# EAGLE design remote (EAGLE 7.6.0)
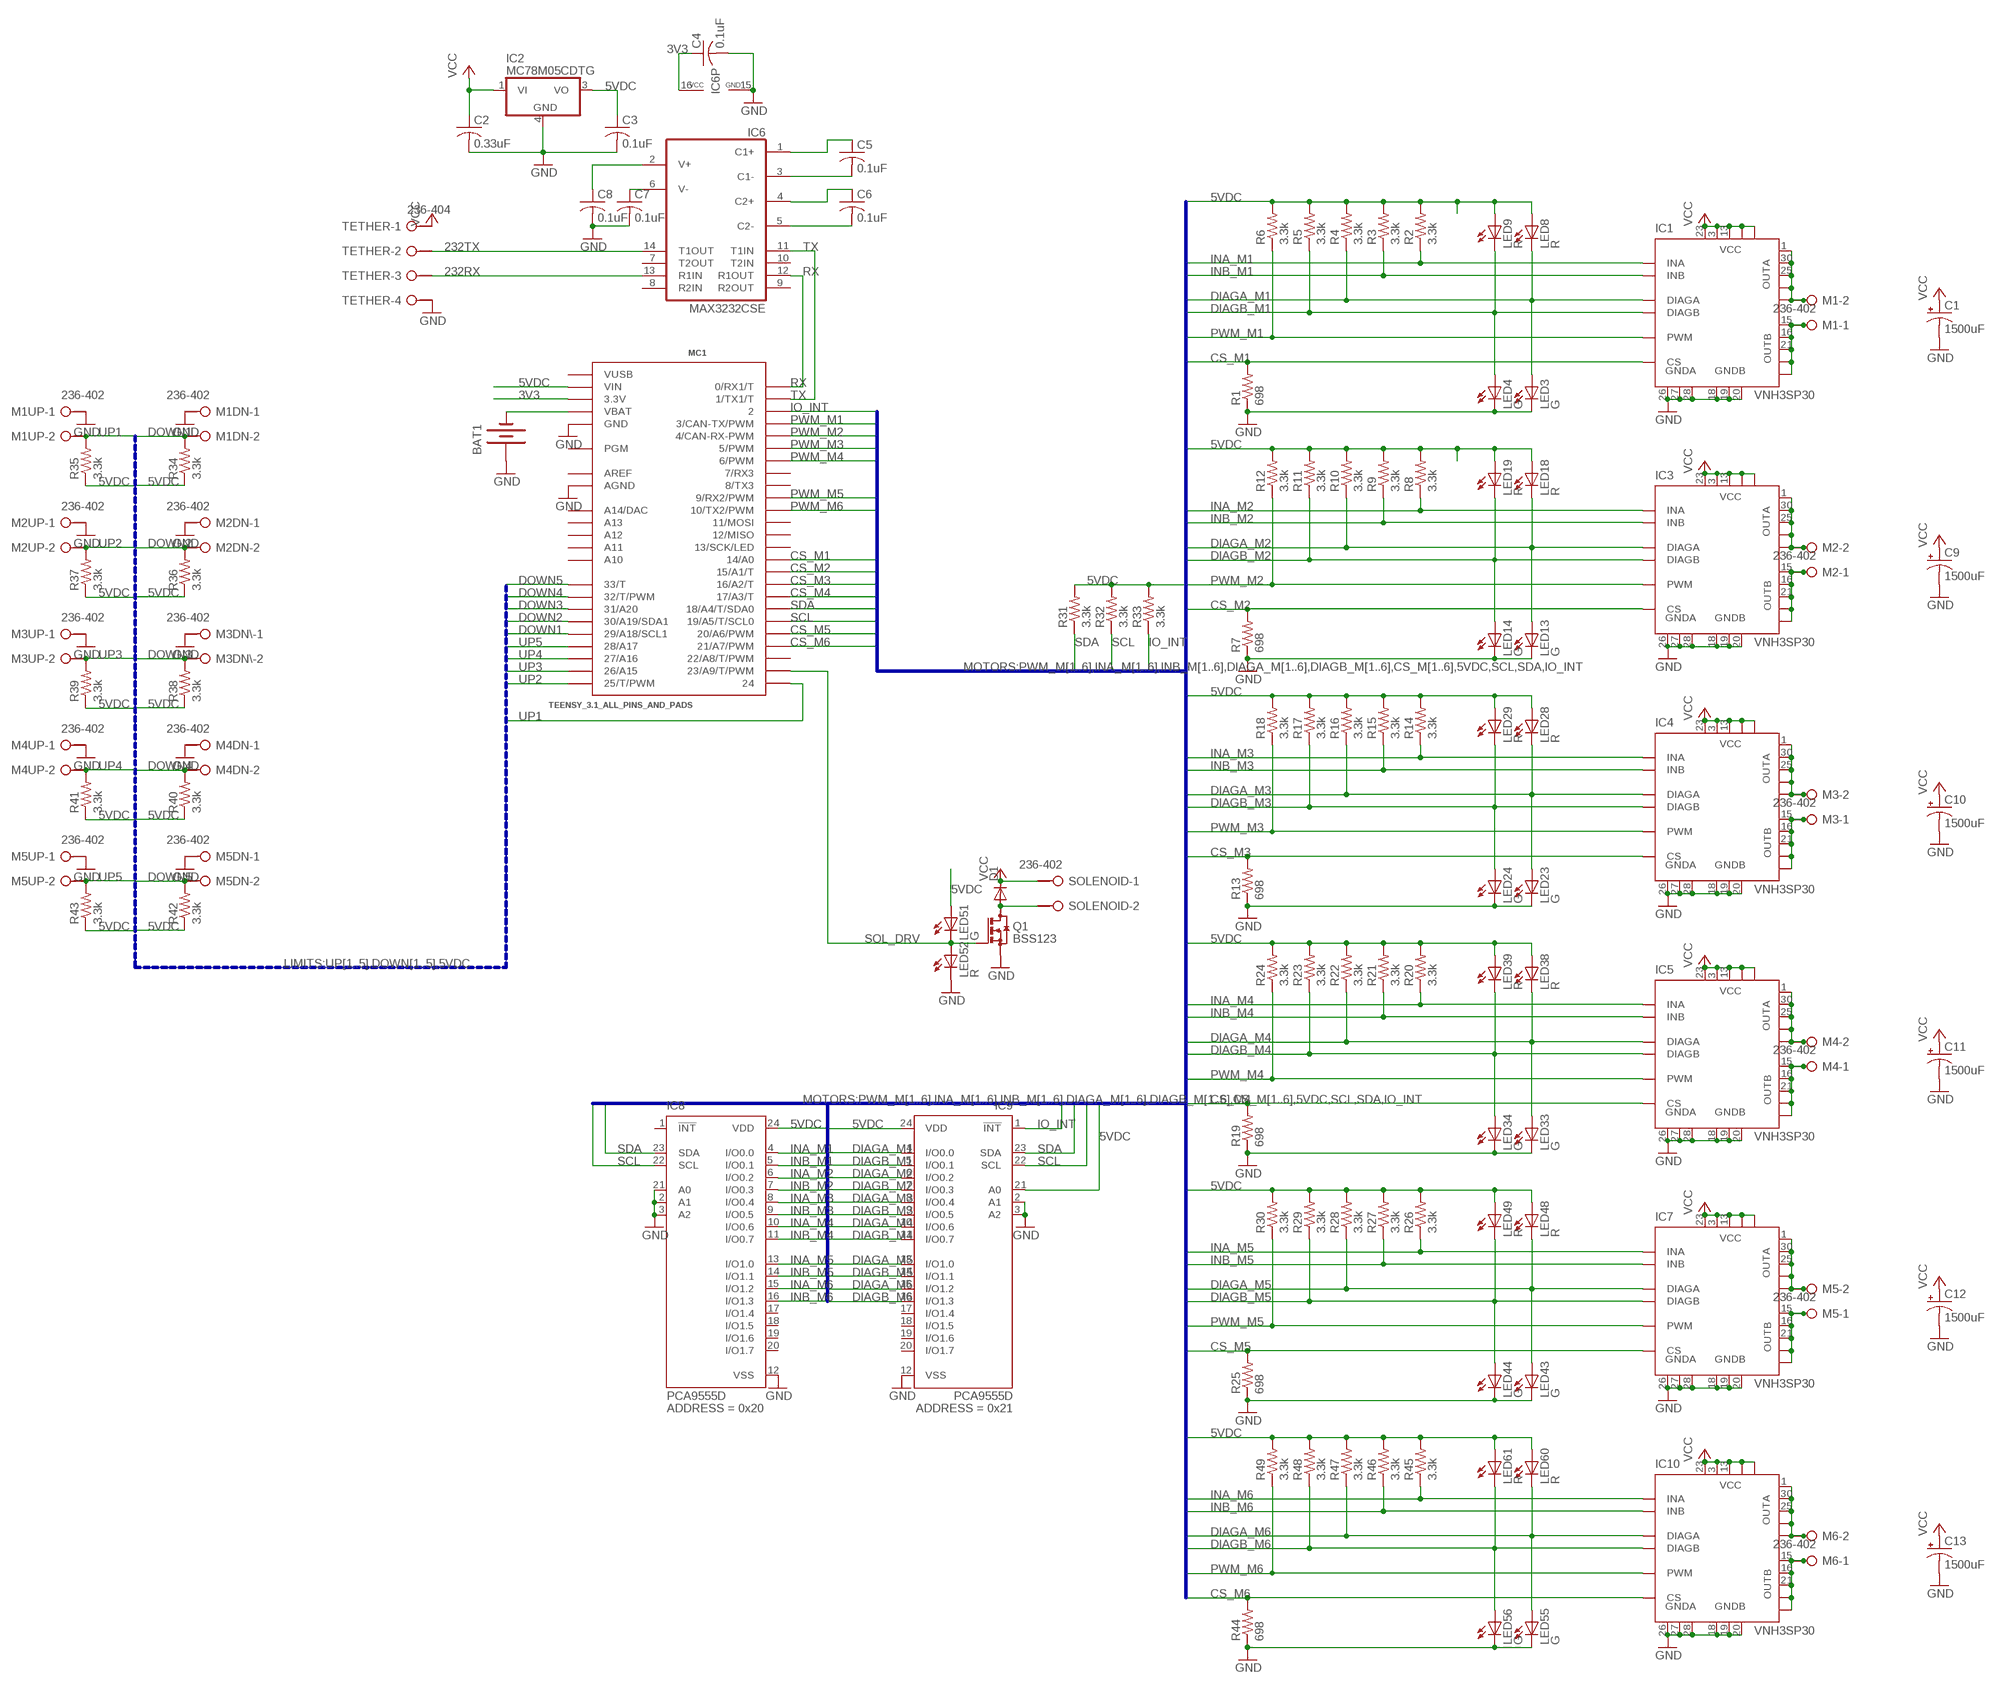
[diagram p0: schematic, sheet 1]

## Parts
BAT1  BATTERY20SMD  [BATTCON_20MM]
C1  1500uF  CPOL-USSANYO_SMD_F12  [SANYO-OSCON_SMD_F12]
C2  0.33uF  C-USC0805  [C0805]
C3  0.1uF  C-USC0805  [C0805]
C4  0.1uF  C-USC0805  [C0805]
C5  0.1uF  C-USC0805  [C0805]
C6  0.1uF  C-USC0805  [C0805]
C7  0.1uF  C-USC0805  [C0805]
C8  0.1uF  C-USC0805  [C0805]
C9  1500uF  CPOL-USSANYO_SMD_F12  [SANYO-OSCON_SMD_F12]
C10  1500uF  CPOL-USSANYO_SMD_F12  [SANYO-OSCON_SMD_F12]
C11  1500uF  CPOL-USSANYO_SMD_F12  [SANYO-OSCON_SMD_F12]
C12  1500uF  CPOL-USSANYO_SMD_F12  [SANYO-OSCON_SMD_F12]
C13  1500uF  CPOL-USSANYO_SMD_F12  [SANYO-OSCON_SMD_F12]
D1  DIODE-DO214AA  [DO214AA]
IC1  VNH3SP30  [MULTIPOWERSO-30]
IC2  MC78M05CDTG  [DPACK_3]
IC3  VNH3SP30  [MULTIPOWERSO-30]
IC4  VNH3SP30  [MULTIPOWERSO-30]
IC5  VNH3SP30  [MULTIPOWERSO-30]
IC6  MAX3232CSE  [SO16]
IC7  VNH3SP30  [MULTIPOWERSO-30]
IC8  PCA9555D  [SO24]
IC9  PCA9555D  [SO24]
IC10  VNH3SP30  [MULTIPOWERSO-30]
LED3  G  LEDCHIP-LED0805  [CHIP-LED0805]
LED4  G  LEDCHIP-LED0805  [CHIP-LED0805]
LED8  R  LEDCHIP-LED0805  [CHIP-LED0805]
LED9  R  LEDCHIP-LED0805  [CHIP-LED0805]
LED13  G  LEDCHIP-LED0805  [CHIP-LED0805]
LED14  G  LEDCHIP-LED0805  [CHIP-LED0805]
LED18  R  LEDCHIP-LED0805  [CHIP-LED0805]
LED19  R  LEDCHIP-LED0805  [CHIP-LED0805]
LED23  G  LEDCHIP-LED0805  [CHIP-LED0805]
LED24  G  LEDCHIP-LED0805  [CHIP-LED0805]
LED28  R  LEDCHIP-LED0805  [CHIP-LED0805]
LED29  R  LEDCHIP-LED0805  [CHIP-LED0805]
LED33  G  LEDCHIP-LED0805  [CHIP-LED0805]
LED34  G  LEDCHIP-LED0805  [CHIP-LED0805]
LED38  R  LEDCHIP-LED0805  [CHIP-LED0805]
LED39  R  LEDCHIP-LED0805  [CHIP-LED0805]
LED43  G  LEDCHIP-LED0805  [CHIP-LED0805]
LED44  G  LEDCHIP-LED0805  [CHIP-LED0805]
LED48  R  LEDCHIP-LED0805  [CHIP-LED0805]
LED49  R  LEDCHIP-LED0805  [CHIP-LED0805]
LED51  G  LEDCHIP-LED0805  [CHIP-LED0805]
LED52  R  LEDCHIP-LED0805  [CHIP-LED0805]
LED55  G  LEDCHIP-LED0805  [CHIP-LED0805]
LED56  G  LEDCHIP-LED0805  [CHIP-LED0805]
LED60  R  LEDCHIP-LED0805  [CHIP-LED0805]
LED61  R  LEDCHIP-LED0805  [CHIP-LED0805]
M1  236-402  [236-402]
M1DN  236-402  [236-402]
M1UP  236-402  [236-402]
M2  236-402  [236-402]
M2DN  236-402  [236-402]
M2UP  236-402  [236-402]
M3  236-402  [236-402]
M3DN\  236-402  [236-402]
M3UP  236-402  [236-402]
M4  236-402  [236-402]
M4DN  236-402  [236-402]
M4UP  236-402  [236-402]
M5  236-402  [236-402]
M5DN  236-402  [236-402]
M5UP  236-402  [236-402]
M6  236-402  [236-402]
MC1  TEENSY_3.1_ALL_PINS_AND_PADS  [TEENSY3_ALL_PINS_&_PADS]
Q1  BSS123  [SOT23]
R1  698  R-US_R0805  [R0805]
R2  3.3k  R-US_R0805  [R0805]
R3  3.3k  R-US_R0805  [R0805]
R4  3.3k  R-US_R0805  [R0805]
R5  3.3k  R-US_R0805  [R0805]
R6  3.3k  R-US_R0805  [R0805]
R7  698  R-US_R0805  [R0805]
R8  3.3k  R-US_R0805  [R0805]
R9  3.3k  R-US_R0805  [R0805]
R10  3.3k  R-US_R0805  [R0805]
R11  3.3k  R-US_R0805  [R0805]
R12  3.3k  R-US_R0805  [R0805]
R13  698  R-US_R0805  [R0805]
R14  3.3k  R-US_R0805  [R0805]
R15  3.3k  R-US_R0805  [R0805]
R16  3.3k  R-US_R0805  [R0805]
R17  3.3k  R-US_R0805  [R0805]
R18  3.3k  R-US_R0805  [R0805]
R19  698  R-US_R0805  [R0805]
R20  3.3k  R-US_R0805  [R0805]
R21  3.3k  R-US_R0805  [R0805]
R22  3.3k  R-US_R0805  [R0805]
R23  3.3k  R-US_R0805  [R0805]
R24  3.3k  R-US_R0805  [R0805]
R25  698  R-US_R0805  [R0805]
R26  3.3k  R-US_R0805  [R0805]
R27  3.3k  R-US_R0805  [R0805]
R28  3.3k  R-US_R0805  [R0805]
R29  3.3k  R-US_R0805  [R0805]
R30  3.3k  R-US_R0805  [R0805]
R31  3.3k  R-US_R0805  [R0805]
R32  3.3k  R-US_R0805  [R0805]
R33  3.3k  R-US_R0805  [R0805]
R34  3.3k  R-US_R0805  [R0805]
R35  3.3k  R-US_R0805  [R0805]
R36  3.3k  R-US_R0805  [R0805]
R37  3.3k  R-US_R0805  [R0805]
R38  3.3k  R-US_R0805  [R0805]
R39  3.3k  R-US_R0805  [R0805]
R40  3.3k  R-US_R0805  [R0805]
R41  3.3k  R-US_R0805  [R0805]
R42  3.3k  R-US_R0805  [R0805]
R43  3.3k  R-US_R0805  [R0805]
R44  698  R-US_R0805  [R0805]
R45  3.3k  R-US_R0805  [R0805]
R46  3.3k  R-US_R0805  [R0805]
R47  3.3k  R-US_R0805  [R0805]
R48  3.3k  R-US_R0805  [R0805]
R49  3.3k  R-US_R0805  [R0805]
SOLENOID  236-402  [236-402]
TETHER  236-404  [236-404]

## Nets
3V3: C4.1 IC6.16(VCC) MC1.3.3V MC1.3.3V1(3.3V) MC1.3.3V2(3.3V)
5VDC: C3.1 IC2.3(VO) IC8.24(VDD) IC9.21(A0) IC9.24(VDD) LED8.A LED9.A LED18.A LED19.A LED28.A LED29.A LED38.A LED39.A LED48.A LED49.A LED51.A LED60.A LED61.A MC1.VIN R2.2 R3.2 R4.2 R5.2 R6.2 R8.2 R9.2 R10.2 R11.2 R12.2 R14.2 R15.2 R16.2 R17.2 R18.2 R20.2 R21.2 R22.2 R23.2 R24.2 R26.2 R27.2 R28.2 R29.2 R30.2 R31.2 R32.2 R33.2 R34.1 R35.1 R36.1 R37.1 R38.1 R39.1 R40.1 R41.1 R42.1 R43.1 R45.2 R46.2 R47.2 R48.2 R49.2
232RX: IC6.13(R1IN) TETHER.3@1(-3:KL1)
232TX: IC6.14(T1OUT) TETHER.2@1(-2:KL1)
CS_M1: IC1.9(CS) MC1.14/A0 R1.2
CS_M2: IC3.9(CS) MC1.15/A1(15/A1/T) R7.2
CS_M3: IC4.9(CS) MC1.16/A2(16/A2/T) R13.2
CS_M4: IC5.9(CS) MC1.17/A3(17/A3/T) R19.2
CS_M5: IC7.9(CS) MC1.20/A6(20/A6/PWM) R25.2
CS_M6: IC10.9(CS) MC1.21/A7(21/A7/PWM) R44.2
DIAGA_M1: IC1.6(DIAGA) IC9.4(I/O0.0) LED3.A LED8.C R4.1
DIAGA_M2: IC3.6(DIAGA) IC9.6(I/O0.2) LED13.A LED18.C R10.1
DIAGA_M3: IC4.6(DIAGA) IC9.8(I/O0.4) LED23.A LED28.C R16.1
DIAGA_M4: IC5.6(DIAGA) IC9.10(I/O0.6) LED33.A LED38.C R22.1
DIAGA_M5: IC7.6(DIAGA) IC9.13(I/O1.0) LED43.A LED48.C R28.1
DIAGA_M6: IC9.15(I/O1.2) IC10.6(DIAGA) LED55.A LED60.C R47.1
DIAGB_M1: IC1.10(DIAGB) IC9.5(I/O0.1) LED4.A LED9.C R5.1
DIAGB_M2: IC3.10(DIAGB) IC9.7(I/O0.3) LED14.A LED19.C R11.1
DIAGB_M3: IC4.10(DIAGB) IC9.9(I/O0.5) LED24.A LED29.C R17.1
DIAGB_M4: IC5.10(DIAGB) IC9.11(I/O0.7) LED34.A LED39.C R23.1
DIAGB_M5: IC7.10(DIAGB) IC9.14(I/O1.1) LED44.A LED49.C R29.1
DIAGB_M6: IC9.16(I/O1.3) IC10.10(DIAGB) LED56.A LED61.C R48.1
DOWN1: M1DN.2@1(-2:KL1) MC1.29(29/A18/SCL1) R34.2
DOWN2: M2DN.2@1(-2:KL1) MC1.30(30/A19/SDA1) R36.2
DOWN3: M3DN\.2@1(-2:KL1) MC1.31(31/A20) R38.2
DOWN4: M4DN.2@1(-2:KL1) MC1.32(32/T/PWM) R40.2
DOWN5: M5DN.2@1(-2:KL1) MC1.33(33/T) R42.2
GND: BAT1.1(+) C1.- C2.2 C3.2 C4.2 C7.2 C8.2 C9.- C10.- C11.- C12.- C13.- IC1.18(GNDB) IC1.19(GNDB) IC1.20(GNDB) IC1.26(GNDA) IC1.27(GNDA) IC1.28(GNDA) IC2.4(GND) IC3.18(GNDB) IC3.19(GNDB) IC3.20(GNDB) IC3.26(GNDA) IC3.27(GNDA) IC3.28(GNDA) IC4.18(GNDB) IC4.19(GNDB) IC4.20(GNDB) IC4.26(GNDA) IC4.27(GNDA) IC4.28(GNDA) IC5.18(GNDB) IC5.19(GNDB) IC5.20(GNDB) IC5.26(GNDA) IC5.27(GNDA) IC5.28(GNDA) IC6.15(GND) IC7.18(GNDB) IC7.19(GNDB) IC7.20(GNDB) IC7.26(GNDA) IC7.27(GNDA) IC7.28(GNDA) IC8.2(A1) IC8.3(A2) IC8.12(VSS) IC8.21(A0) IC9.2(A1) IC9.3(A2) IC9.12(VSS) IC10.18(GNDB) IC10.19(GNDB) IC10.20(GNDB) IC10.26(GNDA) IC10.27(GNDA) IC10.28(GNDA) LED3.C LED4.C LED13.C LED14.C LED23.C LED24.C LED33.C LED34.C LED43.C LED44.C LED52.C LED55.C LED56.C M1DN.1@1(-1:KL1) M1UP.1@1(-1:KL1) M2DN.1@1(-1:KL1) M2UP.1@1(-1:KL1) M3DN\.1@1(-1:KL1) M3UP.1@1(-1:KL1) M4DN.1@1(-1:KL1) M4UP.1@1(-1:KL1) M5DN.1@1(-1:KL1) M5UP.1@1(-1:KL1) MC1.AGND MC1.GND MC1.GND1(GND) MC1.GND2(GND) Q1.2(S) R1.1 R7.1 R13.1 R19.1 R25.1 R44.1 TETHER.4@1(-4:KL1)
INA_M1: IC1.5(INA) IC8.4(I/O0.0) R2.1
INA_M2: IC3.5(INA) IC8.6(I/O0.2) R8.1
INA_M3: IC4.5(INA) IC8.8(I/O0.4) R14.1
INA_M4: IC5.5(INA) IC8.10(I/O0.6) R20.1
INA_M5: IC7.5(INA) IC8.13(I/O1.0) R26.1
INA_M6: IC8.15(I/O1.2) IC10.5(INA) R45.1
INB_M1: IC1.11(INB) IC8.5(I/O0.1) R3.1
INB_M2: IC3.11(INB) IC8.7(I/O0.3) R9.1
INB_M3: IC4.11(INB) IC8.9(I/O0.5) R15.1
INB_M4: IC5.11(INB) IC8.11(I/O0.7) R21.1
INB_M5: IC7.11(INB) IC8.14(I/O1.1) R27.1
INB_M6: IC8.16(I/O1.3) IC10.11(INB) R46.1
IO_INT: IC9.1(!INT) MC1.2 R33.1
M1A: IC1.1(OUTA) IC1.25(OUTA) IC1.30(OUTA) IC1.OUTA IC1.OUTA@1(OUTA) M1.2@1(-2:KL1) M1.2@2(-2:KL2)
M1B: IC1.15(OUTB) IC1.16(OUTB) IC1.21(OUTB) IC1.OUTB IC1.OUTB@1(OUTB) M1.1@1(-1:KL1) M1.1@2(-1:KL2)
M2A: IC3.1(OUTA) IC3.25(OUTA) IC3.30(OUTA) IC3.OUTA IC3.OUTA@1(OUTA) M2.2@1(-2:KL1) M2.2@2(-2:KL2)
M2B: IC3.15(OUTB) IC3.16(OUTB) IC3.21(OUTB) IC3.OUTB IC3.OUTB@1(OUTB) M2.1@1(-1:KL1) M2.1@2(-1:KL2)
M3A: IC4.1(OUTA) IC4.25(OUTA) IC4.30(OUTA) IC4.OUTA IC4.OUTA@1(OUTA) M3.2@1(-2:KL1) M3.2@2(-2:KL2)
M3B: IC4.15(OUTB) IC4.16(OUTB) IC4.21(OUTB) IC4.OUTB IC4.OUTB@1(OUTB) M3.1@1(-1:KL1) M3.1@2(-1:KL2)
M4A: IC5.1(OUTA) IC5.25(OUTA) IC5.30(OUTA) IC5.OUTA IC5.OUTA@1(OUTA) M4.2@1(-2:KL1) M4.2@2(-2:KL2)
M4B: IC5.15(OUTB) IC5.16(OUTB) IC5.21(OUTB) IC5.OUTB IC5.OUTB@1(OUTB) M4.1@1(-1:KL1) M4.1@2(-1:KL2)
M5A: IC7.1(OUTA) IC7.25(OUTA) IC7.30(OUTA) IC7.OUTA IC7.OUTA@1(OUTA) M5.2@1(-2:KL1) M5.2@2(-2:KL2)
M5B: IC7.15(OUTB) IC7.16(OUTB) IC7.21(OUTB) IC7.OUTB IC7.OUTB@1(OUTB) M5.1@1(-1:KL1) M5.1@2(-1:KL2)
M6A: IC10.1(OUTA) IC10.25(OUTA) IC10.30(OUTA) IC10.OUTA IC10.OUTA@1(OUTA) M6.2@1(-2:KL1) M6.2@2(-2:KL2)
M6B: IC10.15(OUTB) IC10.16(OUTB) IC10.21(OUTB) IC10.OUTB IC10.OUTB@1(OUTB) M6.1@1(-1:KL1) M6.1@2(-1:KL2)
N$1: C5.1 IC6.1(C1+)
N$2: C5.2 IC6.3(C1-)
N$3: C6.1 IC6.4(C2+)
N$4: C6.2 IC6.5(C2-)
N$7: C8.1 IC6.2(V+)
N$8: C7.1 IC6.6(V-)
N$17: BAT1.2(-) MC1.VBAT
N$19: D1.A Q1.3(D) SOLENOID.2@1(-2:KL1)
PWM_M1: IC1.8(PWM) MC1.3(3/CAN-TX/PWM) R6.1
PWM_M2: IC3.8(PWM) MC1.4(4/CAN-RX-PWM) R12.1
PWM_M3: IC4.8(PWM) MC1.5(5/PWM) R18.1
PWM_M4: IC5.8(PWM) MC1.6(6/PWM) R24.1
PWM_M5: IC7.8(PWM) MC1.9(9/RX2/PWM) R30.1
PWM_M6: IC10.8(PWM) MC1.10(10/TX2/PWM) R49.1
RX: IC6.12(R1OUT) MC1.0(0/RX1/T)
SCL: IC8.22(SCL) IC9.22(SCL) MC1.19/A5(19/A5/T/SCL0) R32.1
SDA: IC8.23(SDA) IC9.23(SDA) MC1.18/A4(18/A4/T/SDA0) R31.1
SOL_DRV: LED51.C LED52.A MC1.23/A9(23/A9/T/PWM) Q1.1(G)
TX: IC6.11(T1IN) MC1.1(1/TX1/T)
UP1: M1UP.2@1(-2:KL1) MC1.24 R35.2
UP2: M2UP.2@1(-2:KL1) MC1.25(25/T/PWM) R37.2
UP3: M3UP.2@1(-2:KL1) MC1.26(26/A15) R39.2
UP4: M4UP.2@1(-2:KL1) MC1.27(27/A16) R41.2
UP5: M5UP.2@1(-2:KL1) MC1.28(28/A17) R43.2
VCC: C1.+ C2.1 C9.+ C10.+ C11.+ C12.+ C13.+ D1.C IC1.3(VCC) IC1.13(VCC) IC1.23(VCC) IC1.VCC IC1.VCC@1(VCC) IC2.1(VI) IC3.3(VCC) IC3.13(VCC) IC3.23(VCC) IC3.VCC IC3.VCC@1(VCC) IC4.3(VCC) IC4.13(VCC) IC4.23(VCC) IC4.VCC IC4.VCC@1(VCC) IC5.3(VCC) IC5.13(VCC) IC5.23(VCC) IC5.VCC IC5.VCC@1(VCC) IC7.3(VCC) IC7.13(VCC) IC7.23(VCC) IC7.VCC IC7.VCC@1(VCC) IC10.3(VCC) IC10.13(VCC) IC10.23(VCC) IC10.VCC IC10.VCC@1(VCC) SOLENOID.1@1(-1:KL1) TETHER.1@1(-1:KL1)
Unconnected: IC6.7(T2OUT) IC6.8(R2IN) IC6.9(R2OUT) IC6.10(T2IN) IC8.1(!INT) IC8.17(I/O1.4) IC8.18(I/O1.5) IC8.19(I/O1.6) IC8.20(I/O1.7) IC9.17(I/O1.4) IC9.18(I/O1.5) IC9.19(I/O1.6) IC9.20(I/O1.7) M1DN.1@2(-1:KL2) M1DN.2@2(-2:KL2) M1UP.1@2(-1:KL2) M1UP.2@2(-2:KL2) M2DN.1@2(-1:KL2) M2DN.2@2(-2:KL2) M2UP.1@2(-1:KL2) M2UP.2@2(-2:KL2) M3DN\.1@2(-1:KL2) M3DN\.2@2(-2:KL2) M3UP.1@2(-1:KL2) M3UP.2@2(-2:KL2) M4DN.1@2(-1:KL2) M4DN.2@2(-2:KL2) M4UP.1@2(-1:KL2) M4UP.2@2(-2:KL2) M5DN.1@2(-1:KL2) M5DN.2@2(-2:KL2) M5UP.1@2(-1:KL2) M5UP.2@2(-2:KL2) MC1.7(7/RX3) MC1.8(8/TX3) MC1.11(11/MOSI) MC1.12(12/MISO) MC1.13(13/SCK/LED) MC1.22/A8(22/A8/T/PWM) MC1.A10 MC1.A11 MC1.A12 MC1.A13 MC1.PGM MC1.RESET/DAC(A14/DAC) SOLENOID.1@2(-1:KL2) SOLENOID.2@2(-2:KL2) TETHER.1@2(-1:KL2) TETHER.2@2(-2:KL2) TETHER.3@2(-3:KL2) TETHER.4@2(-4:KL2)

## Buses
MOTORS:PWM_M[1..6],INA_M[1..6],INB_M[1..6],DIAGA_M[1..6],DIAGB_M[1..6],CS_M[1..6],5VDC,SCL,SDA,IO_INT
LIMITS:UP[1..5],DOWN[1..5],5VDC

## Power pins joined to a net without a drawn wire
AREF: MC1.AREF
VUSB: MC1.VUSB

## Library data of the parts
BAT1 = SparkFun-Electromechanical:BATTERY: Battery Holders Various common sizes : AA, AAA, 18650 (PRT-12895), 20mm coin cell and 12mm coin cell. 20MM_4LEGS, BATT-10373
C1 C9-C13 = rcl:CPOL-US: POLARIZED CAPACITOR, American symbol
C2-C8 = rcl:C-US: CAPACITOR, American symbol
D1 = diode:DIODE-: DIODE
IC1 IC3-IC5 IC7 IC10 = st-microelectronics:VNH3SP30: FULLY INTEGRATED H-BRIDGE MOTOR DRIVER Source: http://pdf1.alldatasheet.com/datasheet-pdf/view/84563/STMICROELECTRONICS/VNH3SP30.html; MPN: VNH3SP30-E; OC_FARNELL: 1739420; OC_NEWARK: 33R1486
IC2 = linear:MC78M: 500 mA Positive Voltage Regulators Source: Data sheet <http://www.onsemi.com/pub_link/Collateral/MC78M00-D.PDF>
IC6 = maxim:MAX3232*: True RS-232 Transceivers 3.0V to 5.5V, Low-Power up to 1Mbps, Using Four 0.1µF External Capacitors Source: http://pdfserv.maxim-ic.com/en/ds/MAX3222-MAX3241.pdf; MPN: MAX3232CSE; OC_FARNELL: 9725490; OC_NEWARK: 90C2890
IC8 = micro-philips:PCA9555: 16-bit I2C and SMBus I/O port with interrupt Source: PCA9555_5.pdf; ADDRESS: 0x20; MPN: PCA9555DW; OC_FARNELL: 1408295; OC_NEWARK: 63K6067
IC9 = micro-philips:PCA9555: 16-bit I2C and SMBus I/O port with interrupt Source: PCA9555_5.pdf; ADDRESS: 0x21; MPN: PCA9555DW; OC_FARNELL: 1408295; OC_NEWARK: 63K6067
LED3 LED4 LED8 LED9 LED13 LED14 LED18 LED19 LED23 LED24 LED28 LED29 LED33 LED34 LED38 LED39 LED43 LED44 LED48 LED49 LED51 LED52 LED55 LED56 LED60 LED61 = led:LED: LED OSRAM: - CHIPLED LG R971, LG N971, LY N971, LG Q971, LY Q971, LO R971, LY R971 LH N974, LH R974 LS Q976, LO Q976, LY Q976 LO Q996 - Hyper CHIPLED LW Q18S LB Q993, LB Q99A, LB R99A - SideLED LS A670, LO A670, LY A670, LG A670, LP A670 LB A673, LV A673, LT A673, LW A673 LH A674 LY A675 LS A676, LA A676, LO A676, LY A676, LW A676 LS A679, LY A679, LG A679 - Hyper Micro SIDELED® LS Y876, LA Y876, LO Y876, LY Y876 LT Y87S - SmartLED LW L88C, LW L88S LB L89C, LB L89S, LG L890 LS L89K, LO L89K, LY L89K LS L896, LA L896, LO L896, LY L896 - TOPLED LS T670, LO T670, LY T670, LG T670, LP T670 LSG T670, LSP T670, LSY T670, LOP T670, LYG T670 LG T671, LOG T671, LSG T671 LB T673, LV T673, LT T673, LW T673 LH T674 LS T676, LA T676, LO T676, LY T676, LB T676, LH T676, LSB T676, LW T676 LB T67C, LV T67C, LT T67C, LS T67K, LO T67K, LY T67K, LW E67C LS E67B, LA E67B, LO E67B, LY E67B, LB E67C, LV E67C, LT E67C LW T67C LS T679, LY T679, LG T679 LS T770, LO T770, LY T770, LG T770, LP T770 LB T773, LV T773, LT T773, LW T773 LH T774 LS E675, LA E675, LY E675, LS T675 LS T776, LA T776, LO T776, LY T776, LB T776 LHGB T686 LT T68C, LB T68C - Hyper Mini TOPLED® LB M676 - Mini TOPLED Santana® LG M470 LS M47K, LO M47K, LY M47K Source: http://www.osram.convergy.de LUXEON: - LUMILED® LXK2-PW12-R00, LXK2-PW12-S00, LXK2-PW14-U00, LXK2-PW14-V00 LXK2-PM12-R00, LXK2-PM12-S00, LXK2-PM14-U00 LXK2-PE12-Q00, LXK2-PE12-R00, LXK2-PE12-S00, LXK2-PE14-T00, LXK2-PE14-U00 LXK2-PB12-K00, LXK2-PB12-L00, LXK2-PB12-M00, LXK2-PB14-N00, LXK2-PB14-P00, LXK2-PB14-Q00 LXK2-PR12-L00, LXK2-PR12-M00, LXK2-PR14-Q00, LXK2-PR14-R00 LXK2-PD12-Q00, LXK2-PD12-R00, LXK2-PD12-S00 LXK2-PH12-R00, LXK2-PH12-S00 LXK2-PL12-P00, LXK2-PL12-Q00, LXK2-PL12-R00 Source: www.luxeon.com KINGBRIGHT: KA-3528ASYC Source: www.kingbright.com
M1 M1DN M1UP M2 M2DN M2UP M3 M3DN\ M3UP M4 M4DN M4UP M5 M5DN M5UP M6 SOLENOID = con-wago-508:236-402: Terminal Strips 2.5 mm2/AWG 12, Series 236, Pin Spacings 5/5.08 mm Source: Data sheet <http://www.farnell.com/datasheets/63479.pdf>
MC1 = Teensy_3_and_LC_Series_Boards_v1.1:TEENSY_3.1_ALL_PINS_AND_PADS: Footprint for Teensy 3.1 or 3.2 board using all pads and all through-holes. Pads need a 2x7 0.1" SMD header.
Q1 = transistor-small-signal:BSS123: N-CHANNEL MOS FET
R1-R49 = resistor:R-US_: RESISTOR, American symbol
TETHER = con-wago-508:236-404: Terminal Strips 2.5 mm2/AWG 12, Series 236, Pin Spacings 5/5.08 mm Source: Data sheet <http://www.farnell.com/datasheets/63479.pdf>

## Net classes
0 default: clearance 0.205 mm

## Board
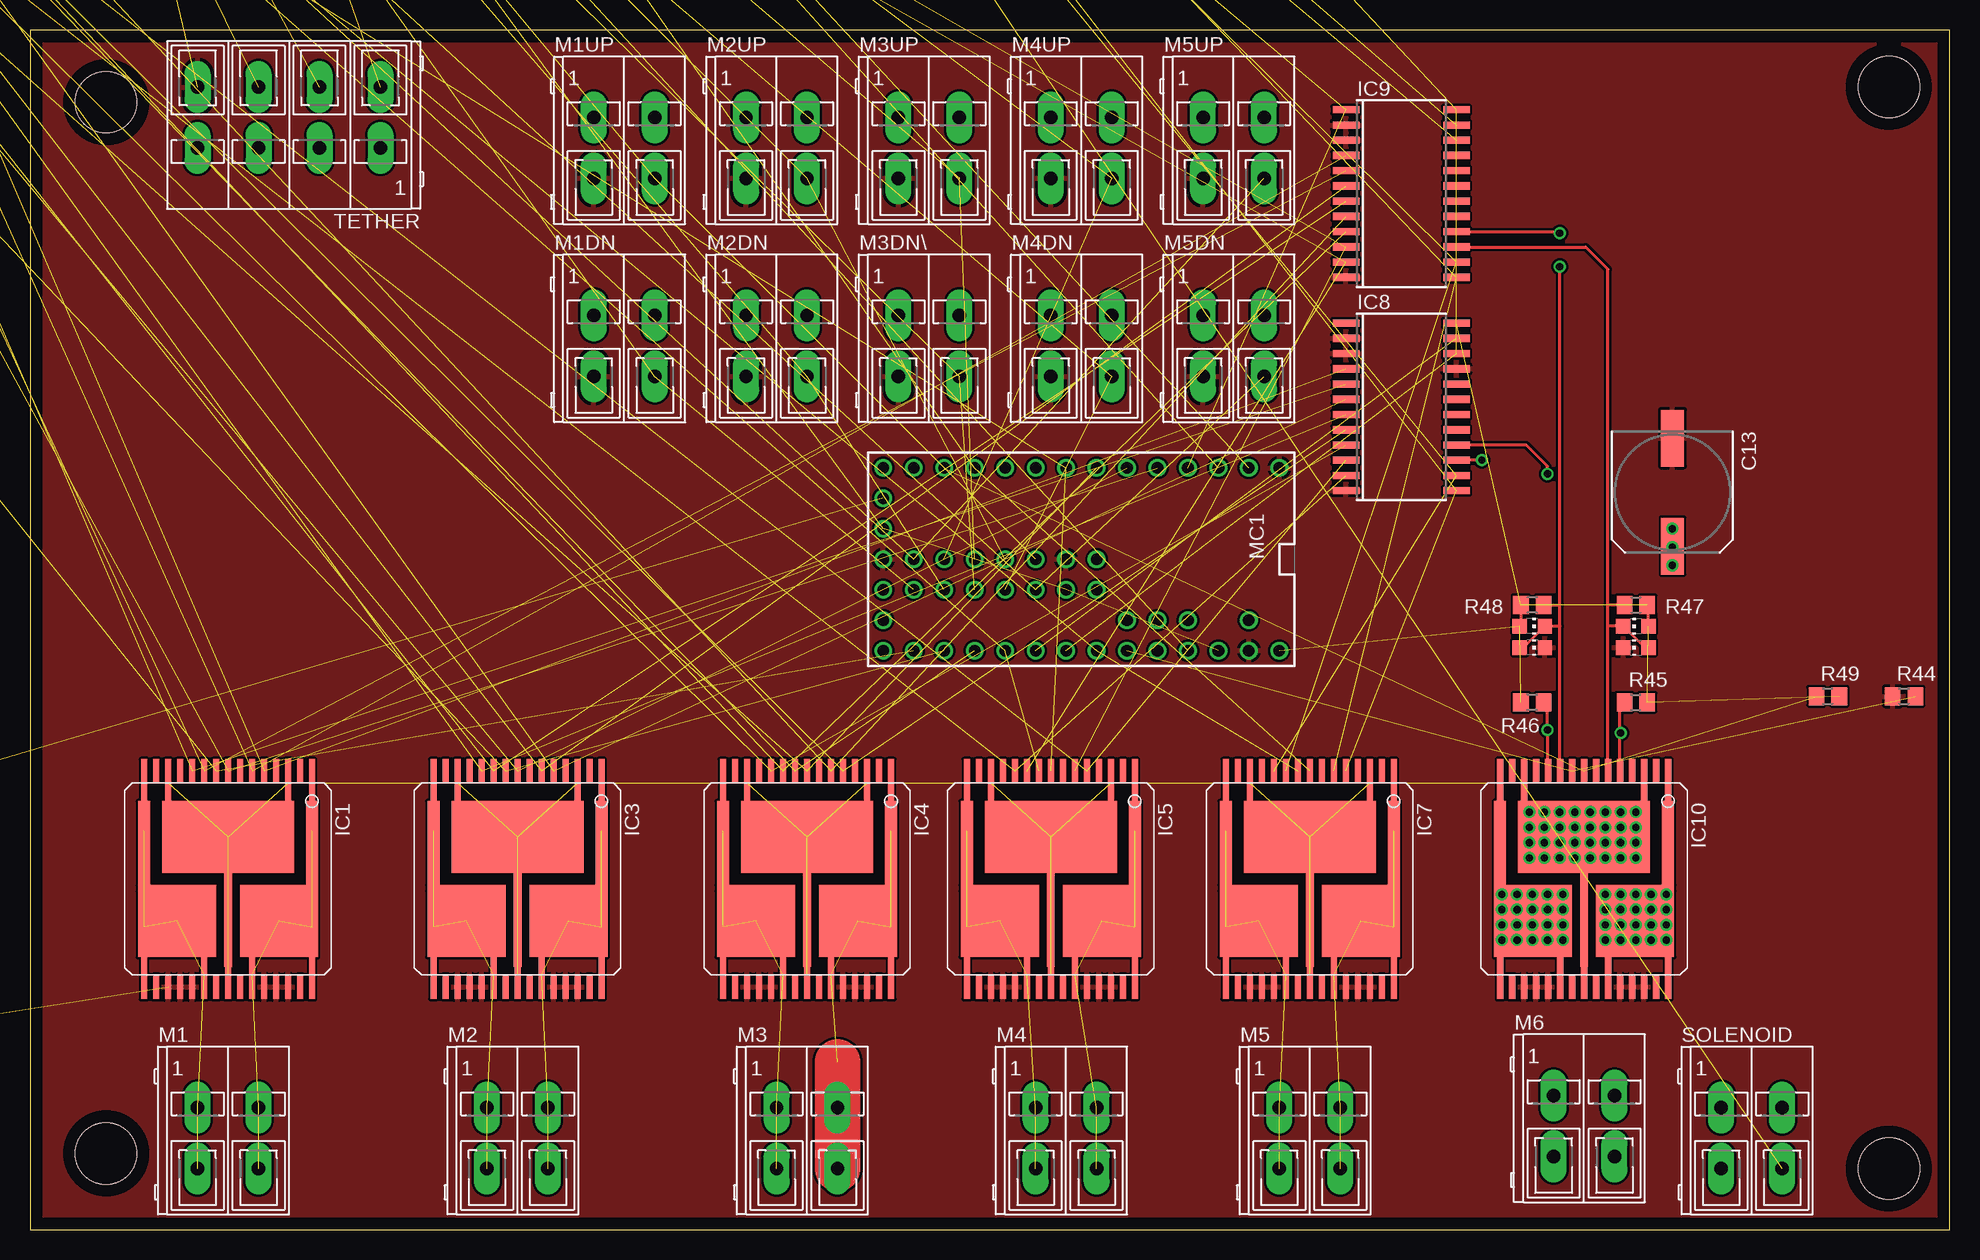
[diagram p1: board, top side]
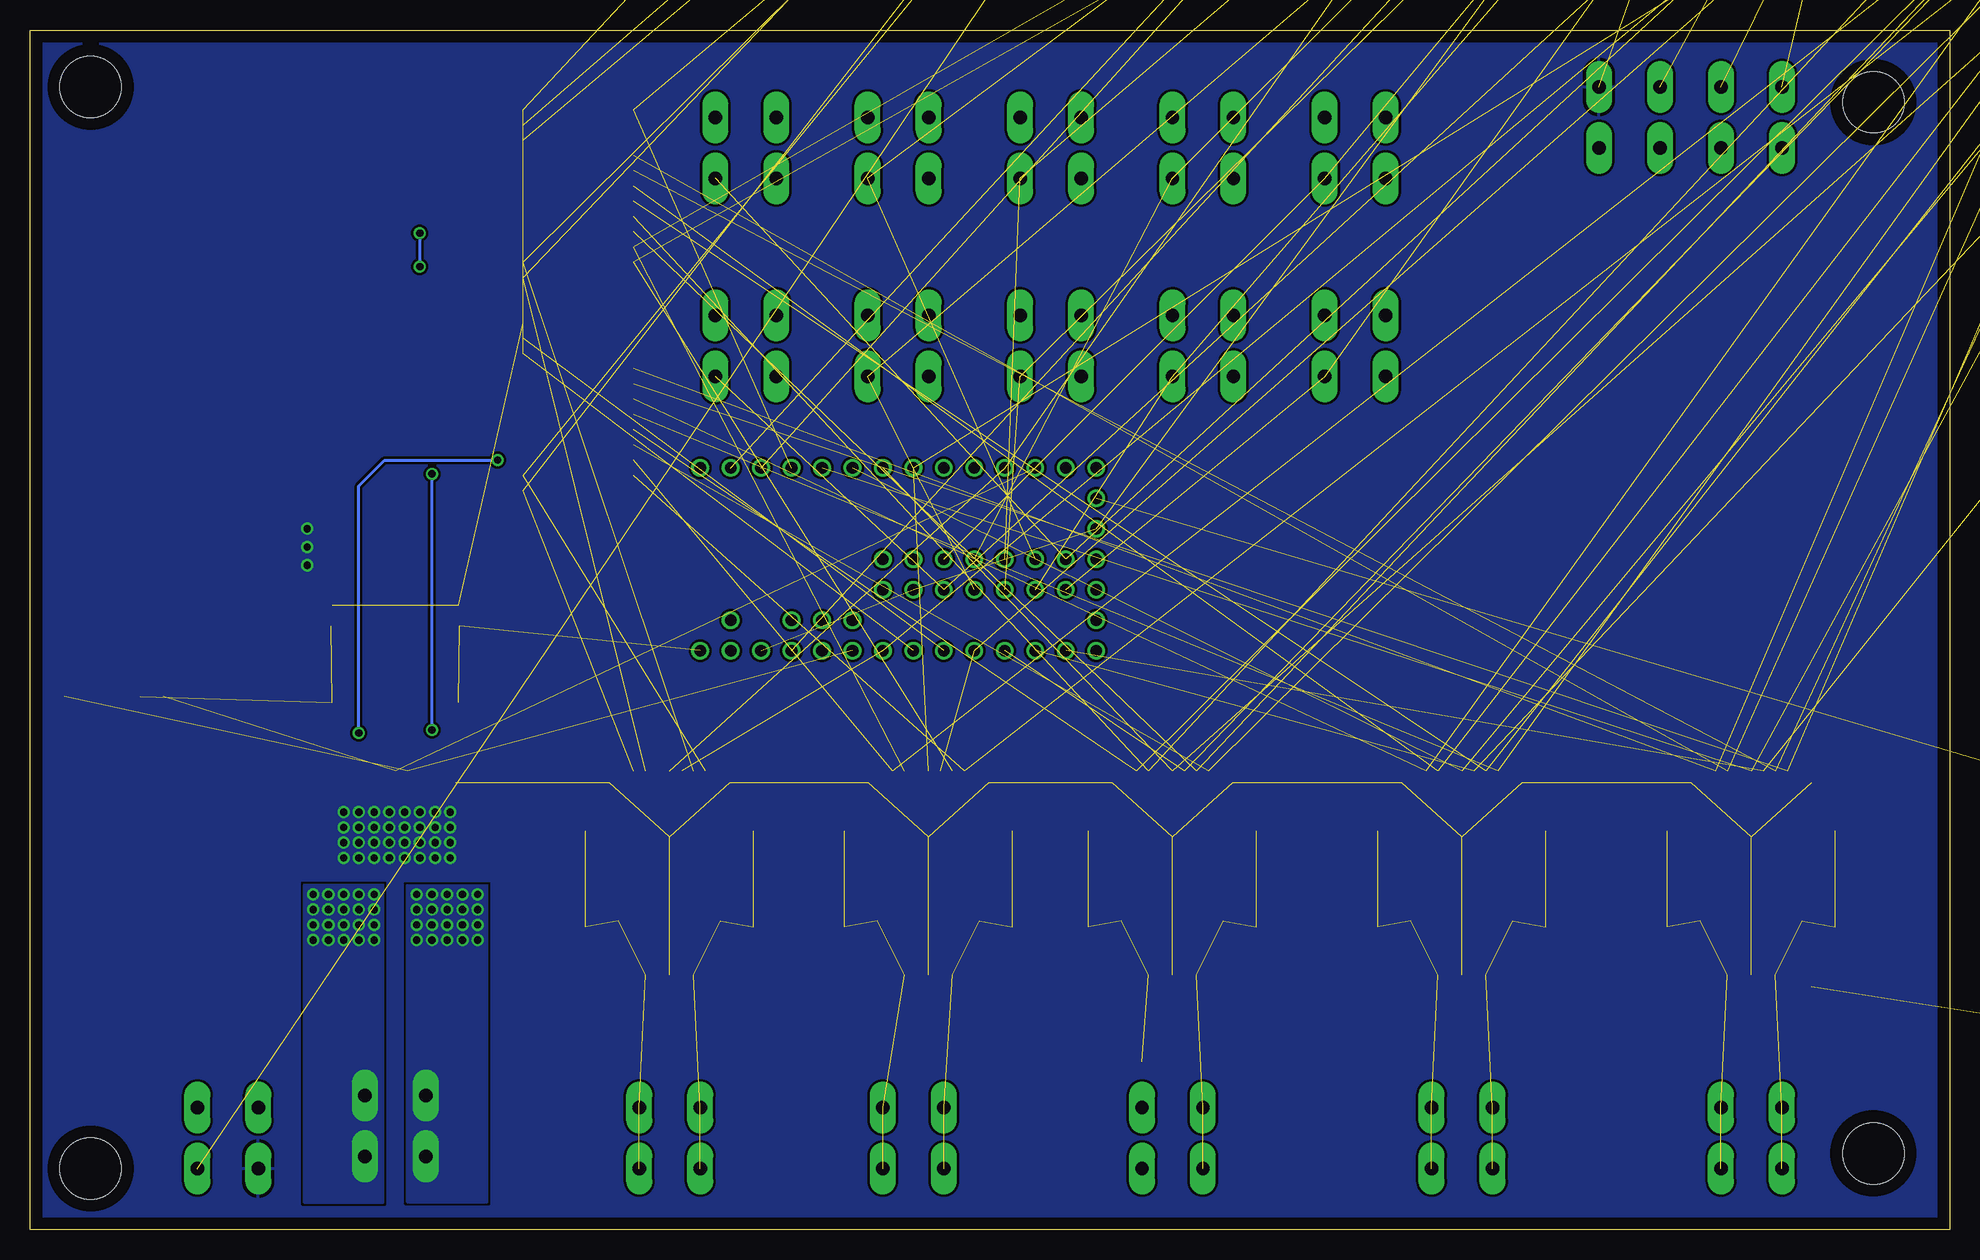
[diagram p2: board, bottom side, seen from below]

Size 160 x 100 mm. Coordinates in mm from the lower left corner, seen from the top.
Outline: 0,0 160,0 160,100 0,100 0,0
Copper layers (1*16): Top 0.035mm / dielectric 1.5mm / Bottom 0.035mm
Design rules "default *": minimum track width 10mil, minimum drill 12mil, track to track 8mil, track to pad 8mil, pad to pad 8mil, via to via 8mil, smd to smd 0mil, copper to edge 40mil, drill to drill 8mil, minimum pad ring 10mil, minimum via ring 8mil, stop-mask expansion 4mil, vias tented up to drill 0mil, thermal gap 10mil
Holes 5.11 mm at 6.35,93.98 6.35,6.35 154.94,95.25 154.94,5.08

### Footprints (pad centres in the part's own frame; a part is rotated, then mirrored left to right if it is on the bottom)
BATTCON_20MM = smd 6.07 x 6.07: 1 -12.5,0; 2 0,0; 3 12.5,0
SANYO-OSCON_SMD_F12 = smd 4.7 x 1.9: + 4.5,0; - -4.5,0
C0805 = smd 1.3 x 1.5: 1 -0.95,0; 2 0.95,0
DO214AA = smd 1.8 x 2.2: A 2.55,0; C -2.55,0
MULTIPOWERSO-30 = smd 0.508 x 12: 1 -7,-4; 15 7,-4; 16 7,4; 30 -7,4 | smd 0.508 x 2: 2 -6,-9; 4 -4,-9; 5 -3,-9; 6 -2,-9; 7 -1,-9; 8 0,-9; 9 1,-9; 10 2,-9; 11 3,-9; 12 4,-9; 14 6,-9; 17 6,9; 18 5,9; 19 4,9; 20 3,9; 22 1,9; 24 -1,9; 26 -3,9; 27 -4,9; 28 -5,9; 29 -6,9 | smd 0.508 x 4: 3 -5,-8; 13 5,-8; 21 2,8; 23 0,8; 25 -2,8 | smd 6.5 x 6: OUTA -4.25,3.5; OUTB 4.25,3.5 | smd 1 x 7.5: OUTA@1 -7,-2.755; OUTB@1 7,-2.755 | smd 11 x 6: VCC 0,-3.5 | smd 0.65 x 8.3: VCC@1 0,3.145
DPACK_3 = smd 1 x 1.6: 1 -2.28,-4.8; 3 2.28,-4.8 | smd 5.4 x 6.2: 4 0,2.5
SO16 = smd 0.66 x 2.032: 1 -4.445,-3.073; 2 -3.175,-3.073; 3 -1.905,-3.073; 4 -0.635,-3.073; 5 0.635,-3.073; 6 1.905,-3.073; 7 3.175,-3.073; 8 4.445,-3.073; 9 4.445,3.073; 10 3.175,3.073; 11 1.905,3.073; 12 0.635,3.073; 13 -0.635,3.073; 14 -1.905,3.073; 15 -3.175,3.073; 16 -4.445,3.073
SO24 = smd 0.6 x 2.2: 1 -6.985,-4.6; 2 -5.715,-4.6; 3 -4.445,-4.6; 4 -3.175,-4.6; 5 -1.905,-4.6; 6 -0.635,-4.6; 7 0.635,-4.6; 8 1.905,-4.6; 9 3.175,-4.6; 10 4.445,-4.6; 11 5.715,-4.6; 12 6.985,-4.6; 13 6.985,4.6; 14 5.715,4.6; 15 4.445,4.6; 16 3.175,4.6; 17 1.905,4.6; 18 0.635,4.6; 19 -0.635,4.6; 20 -1.905,4.6; 21 -3.175,4.6; 22 -4.445,4.6; 23 -5.715,4.6; 24 -6.985,4.6
CHIP-LED0805 = smd 1.2 x 1.2: A 0,-1.05; C 0,1.05
236-402 = drill 1.118 pad 2.184 long: 1@1 -2.54,-3.81; 1@2 -2.54,1.27; 2@1 2.54,-3.81; 2@2 2.54,1.27
TEENSY3_ALL_PINS_&_PADS = drill 0.965: 0 -7.62,13.97; 1 -7.62,11.43; 2 -7.62,8.89; 3 -7.62,6.35; 3.3V 7.62,11.43; 3.3V1 -2.54,-16.51; 3.3V2 2.54,-1.27; 4 -7.62,3.81; 5 -7.62,1.27; 6 -7.62,-1.27; 7 -7.62,-3.81; 8 -7.62,-6.35; 9 -7.62,-8.89; 10 -7.62,-11.43; 11 -7.62,-13.97; 12 -7.62,-16.51; 13 7.62,-16.51; 14/A0 7.62,-13.97; 15/A1 7.62,-11.43; 16/A2 7.62,-8.89; 17/A3 7.62,-6.35; 18/A4 7.62,-3.81; 19/A5 7.62,-1.27; 20/A6 7.62,1.27; 21/A7 7.62,3.81; 22/A8 7.62,6.35; 23/A9 7.62,8.89; 24 0,-3.81; 25 0,-6.35; 26 0,-8.89; 27 0,-11.43; 28 0,-13.97; 29 2.54,-13.97; 30 2.54,-11.43; 31 2.54,-8.89; 32 2.54,-6.35; 33 2.54,-3.81; A10 5.08,6.35; A11 5.08,3.81; A12 0,1.27; A13 2.54,1.27; AGND 7.62,13.97; AREF 5.08,8.89; GND -7.62,16.51; GND1 0,-16.51; GND2 0,-1.27; PGM 2.54,-16.51; RESET/DAC 5.08,-16.51; VBAT -5.08,-16.51; VIN 7.62,16.51; VUSB 5.08,13.97
SOT23 = smd 1 x 1.4: 1 -0.95,-1.1; 2 0.95,-1.1; 3 0,1.1
R0805 = smd 1.3 x 1.5: 1 -0.95,0; 2 0.95,0
236-404 = drill 1.118 pad 2.184 long: 1@1 -7.62,-3.81; 1@2 -7.62,1.27; 2@1 -2.54,-3.81; 2@2 -2.54,1.27; 3@1 2.54,-3.81; 3@2 2.54,1.27; 4@1 7.62,-3.81; 4@2 7.62,1.27

### Placement (x,y rotation side)
BAT1  -168.91,-10.16 0 top  (outside the outline)
C1  -95.25,196.85 0 top  (outside the outline)
C2  -17.78,231.14 0 top  (outside the outline)
C3  -24.13,231.14 0 top  (outside the outline)
C4  -30.48,231.14 0 top  (outside the outline)
C5  -36.83,231.14 0 top  (outside the outline)
C6  -43.18,231.14 0 top  (outside the outline)
C7  -49.53,231.14 0 top  (outside the outline)
C8  -55.88,231.14 0 top  (outside the outline)
C9  -109.22,196.85 0 top  (outside the outline)
C10  -123.19,196.85 0 top  (outside the outline)
C11  -137.16,196.85 0 top  (outside the outline)
C12  -151.13,196.85 0 top  (outside the outline)
C13  136.91,61.47 270 top
D1  -16.51,242.57 0 top  (outside the outline)
IC1  16.51,29.21 180 top
IC2  -82.55,195.58 0 top  (outside the outline)
IC3  40.64,29.21 180 top
IC4  64.77,29.21 180 top
IC5  85.09,29.21 180 top
IC6  -39.37,212.09 0 top  (outside the outline)
IC7  106.68,29.21 180 top
IC8  114.3,68.58 270 top
IC9  114.3,86.36 270 top
IC10  129.54,29.21 180 top
LED3  -58.42,210.82 0 top  (outside the outline)
LED4  -64.77,210.82 0 top  (outside the outline)
LED8  -173.99,236.22 0 top  (outside the outline)
LED9  -180.34,236.22 0 top  (outside the outline)
LED13  -90.17,210.82 0 top  (outside the outline)
LED14  -96.52,210.82 0 top  (outside the outline)
LED18  -73.66,222.25 0 top  (outside the outline)
LED19  -80.01,222.25 0 top  (outside the outline)
LED23  -121.92,210.82 0 top  (outside the outline)
LED24  -128.27,210.82 0 top  (outside the outline)
LED28  -105.41,222.25 0 top  (outside the outline)
LED29  -111.76,222.25 0 top  (outside the outline)
LED33  -153.67,210.82 0 top  (outside the outline)
LED34  -160.02,210.82 0 top  (outside the outline)
LED38  -137.16,222.25 0 top  (outside the outline)
LED39  -143.51,222.25 0 top  (outside the outline)
LED43  -16.51,222.25 0 top  (outside the outline)
LED44  -22.86,222.25 0 top  (outside the outline)
LED48  -168.91,222.25 0 top  (outside the outline)
LED49  -175.26,222.25 0 top  (outside the outline)
LED51  -48.26,222.25 0 top  (outside the outline)
LED52  -181.61,222.25 0 top  (outside the outline)
LED55  133.86,48.51 90 top
LED56  125.22,48.51 270 top
LED60  133.86,50.29 90 top
LED61  125.22,50.29 270 top
M1  16.51,8.89 0 top
M1DN  49.53,74.93 0 top
M1UP  49.53,91.44 0 top
M2  40.64,8.89 0 top
M2DN  62.23,74.93 0 top
M2UP  62.23,91.44 0 top
M3  64.77,8.89 0 top
M3DN\  74.93,74.93 0 top
M3UP  74.93,91.44 0 top
M4  86.36,8.89 0 top
M4DN  87.63,74.93 0 top
M4UP  87.63,91.44 0 top
M5  106.68,8.89 0 top
M5DN  100.33,74.93 0 top
M5UP  100.33,91.44 0 top
M6  129.54,9.91 0 top
MC1  87.63,55.88 270 top
Q1  -52.07,212.09 0 top  (outside the outline)
R1  -144.78,237.49 0 top  (outside the outline)
R2  -62.23,231.14 0 top  (outside the outline)
R3  -68.58,231.14 0 top  (outside the outline)
R4  -74.93,231.14 0 top  (outside the outline)
R5  -81.28,231.14 0 top  (outside the outline)
R6  -87.63,231.14 0 top  (outside the outline)
R7  -149.86,237.49 0 top  (outside the outline)
R8  -93.98,231.14 0 top  (outside the outline)
R9  -100.33,231.14 0 top  (outside the outline)
R10  -106.68,231.14 0 top  (outside the outline)
R11  -113.03,231.14 0 top  (outside the outline)
R12  -119.38,231.14 0 top  (outside the outline)
R13  -129.54,237.49 0 top  (outside the outline)
R14  -125.73,231.14 0 top  (outside the outline)
R15  -132.08,231.14 0 top  (outside the outline)
R16  -138.43,231.14 0 top  (outside the outline)
R17  -144.78,231.14 0 top  (outside the outline)
R18  -151.13,231.14 0 top  (outside the outline)
R19  -134.62,237.49 0 top  (outside the outline)
R20  -157.48,231.14 0 top  (outside the outline)
R21  -163.83,231.14 0 top  (outside the outline)
R22  -170.18,231.14 0 top  (outside the outline)
R23  -176.53,231.14 0 top  (outside the outline)
R24  -182.88,231.14 0 top  (outside the outline)
R25  -139.7,237.49 0 top  (outside the outline)
R26  -16.51,237.49 0 top  (outside the outline)
R27  -22.86,237.49 0 top  (outside the outline)
R28  -29.21,237.49 0 top  (outside the outline)
R29  -35.56,237.49 0 top  (outside the outline)
R30  -41.91,237.49 0 top  (outside the outline)
R31  -48.26,237.49 0 top  (outside the outline)
R32  -54.61,237.49 0 top  (outside the outline)
R33  -60.96,237.49 0 top  (outside the outline)
R34  -67.31,237.49 0 top  (outside the outline)
R35  -73.66,237.49 0 top  (outside the outline)
R36  -80.01,237.49 0 top  (outside the outline)
R37  -86.36,237.49 0 top  (outside the outline)
R38  -92.71,237.49 0 top  (outside the outline)
R39  -99.06,237.49 0 top  (outside the outline)
R40  -105.41,237.49 0 top  (outside the outline)
R41  -111.76,237.49 0 top  (outside the outline)
R42  -118.11,237.49 0 top  (outside the outline)
R43  -124.46,237.49 0 top  (outside the outline)
R44  156.21,44.45 0 top
R45  133.86,43.94 0 top
R46  125.22,43.94 180 top
R47  133.86,52.07 0 top
R48  125.22,52.07 180 top
R49  149.86,44.45 0 top
SOLENOID  143.51,8.89 0 top
TETHER  21.59,91.44 180 top

### Tracks (layer width: path | path; a pad name or v marks a point on that pad's centre or on a via)
3V3  (4 unrouted)
5VDC  (59 unrouted)
  Top 0.254: LED60.A 134.91,51.97 R47.2 | R48.2 124.27,50.39 LED61.A
232RX  (1 unrouted)
232TX  (1 unrouted)
CS_M1  (2 unrouted)
CS_M2  (2 unrouted)
CS_M3  (2 unrouted)
CS_M4  (2 unrouted)
CS_M5  (2 unrouted)
CS_M6  (2 unrouted)
DIAGA_M1  (4 unrouted)
DIAGA_M2  (4 unrouted)
DIAGA_M3  (4 unrouted)
DIAGA_M4  (4 unrouted)
DIAGA_M5  (4 unrouted)
DIAGA_M6
  Top 0.254: IC10.6 131.54,50.29 | 131.54,50.29 131.54,52.07 | 131.54,52.07 131.54,80.04 129.67,81.92 IC9.15 | 131.54,50.29 LED60.C 134.59,48.51 LED55.A | R47.1 131.54,52.07
DIAGB_M1  (4 unrouted)
DIAGB_M2  (4 unrouted)
DIAGB_M3  (4 unrouted)
DIAGB_M4  (4 unrouted)
DIAGB_M5  (4 unrouted)
DIAGB_M6  (via drill 0.6)
  Top 0.254: IC10.10 127.54,50.29 | 127.54,50.29 127.54,52.07 | 127.54,52.07 127.54,80.23 v127.51,80.26 | IC9.16 127.38,83.19 v127.51,83.06 | 127.54,50.29 LED61.C 124.49,48.51 LED56.A | R48.1 127.54,52.07
  Bottom 0.254: v127.51,83.06 v127.51,80.26
DOWN1  (2 unrouted)
DOWN2  (2 unrouted)
DOWN3  (2 unrouted)
DOWN4  (2 unrouted)
DOWN5  (2 unrouted)
GND  (30 unrouted)
  pour Top: 0,0 160.02,0 160,100 0,100
INA_M1  (2 unrouted)
INA_M2  (2 unrouted)
INA_M3  (2 unrouted)
INA_M4  (2 unrouted)
INA_M5  (2 unrouted)
INA_M6  (via drill 0.6)
  Top 0.254: IC10.5 132.54,41.35 | 132.54,41.35 v132.59,41.4 | v121.03,64.14 IC8.15 | 132.54,41.35 132.54,43.57 R45.1
  Bottom 0.254: v132.59,41.4 132.59,61.98 130.43,64.14 v121.03,64.14
INB_M1  (2 unrouted)
INB_M2  (2 unrouted)
INB_M3  (2 unrouted)
INB_M4  (2 unrouted)
INB_M5  (2 unrouted)
INB_M6  (via drill 0.6)
  Top 0.254: IC10.11 126.54,41.61 v126.49,41.66 126.49,43.62 R46.1 | v126.49,62.99 126.49,63.63 124.71,65.41 IC8.16
  Bottom 0.254: v126.49,41.66 v126.49,62.99
IO_INT  (2 unrouted)
M1A  (6 unrouted)
M1B  (6 unrouted)
M2A  (6 unrouted)
M2B  (6 unrouted)
M3A  (5 unrouted)
  Top 3.81: M3.2@1 M3.2@2 67.31,13.97
M3B  (6 unrouted)
M4A  (6 unrouted)
M4B  (6 unrouted)
M5A  (6 unrouted)
M5B  (6 unrouted)
M6A  (via drill 0.6)
  Top 0.254: IC10.25 131.54,23.91 v131.32,24.13 | IC10.OUTA 133.79,25.47 v133.86,25.4 | IC10.30 136.54,25.26 v136.4,25.4 | v136.4,27.94 136.4,31.82 IC10.OUTA@1 IC10.1
  other vias: 131.32,27.94 132.59,27.94 133.86,27.94 135.13,27.94 136.4,26.67 135.13,26.67 133.86,26.67 132.59,26.67 131.32,26.67 131.32,25.4 132.59,25.4 135.13,25.4 136.4,24.13 135.13,24.13 133.86,24.13 132.59,24.13
  pour Bottom (no thermals): 130.56,28.7 137.16,28.7 137.16,2.29 130.56,2.29
M6B  (via drill 0.6)
  Top 0.254: IC10.21 127.54,23.91 v127.76,24.13 | IC10.OUTB 125.29,25.47 v125.22,25.4 | IC10.16 122.54,25.26 v122.68,25.4 | v122.68,27.94 122.68,31.82 IC10.OUTB@1 IC10.15
  other vias: 127.76,27.94 126.49,27.94 125.22,27.94 123.95,27.94 122.68,26.67 123.95,26.67 125.22,26.67 126.49,26.67 127.76,26.67 127.76,25.4 126.49,25.4 123.95,25.4 122.68,24.13 123.95,24.13 125.22,24.13 126.49,24.13
  pour Bottom (no thermals): 128.52,28.7 121.92,28.7 121.92,2.29 128.52,2.29
N$1  (1 unrouted)
N$2  (1 unrouted)
N$3  (1 unrouted)
N$4  (1 unrouted)
N$7  (1 unrouted)
N$8  (1 unrouted)
N$17  (1 unrouted)
N$19  (2 unrouted)
PWM_M1  (2 unrouted)
PWM_M2  (2 unrouted)
PWM_M3  (2 unrouted)
PWM_M4  (2 unrouted)
PWM_M5  (2 unrouted)
PWM_M6  (2 unrouted)
RX  (1 unrouted)
SCL  (3 unrouted)
SDA  (3 unrouted)
SOL_DRV  (3 unrouted)
TX  (1 unrouted)
UP1  (2 unrouted)
UP2  (2 unrouted)
UP3  (2 unrouted)
UP4  (2 unrouted)
UP5  (2 unrouted)
VCC  (via drill 0.6)  (33 unrouted)
  Top 0.254: IC10.VCC 129.6,32.71 v130.05,32.26 | v130.05,30.99 129.54,30.48 IC10.VCC@1 IC10.23 | v133.86,34.8 134.54,35.48 IC10.3 | v124.97,34.8 124.54,35.23 IC10.13 | C13.+ v136.91,56.9
  other vias: 126.24,34.8 127.51,34.8 128.78,34.8 130.05,34.8 131.32,34.8 132.59,34.8 124.97,33.53 126.24,33.53 127.51,33.53 128.78,33.53 130.05,33.53 131.32,33.53 132.59,33.53 133.86,33.53 124.97,32.26 126.24,32.26 127.51,32.26 128.78,32.26 131.32,32.26 132.59,32.26 133.86,32.26 124.97,30.99 126.24,30.99 127.51,30.99 128.78,30.99 131.32,30.99 132.59,30.99 133.86,30.99 136.91,58.42 136.91,55.37
  pour Bottom (rank 2): 0,0 160.02,0 160.02,100.08 0,100.08